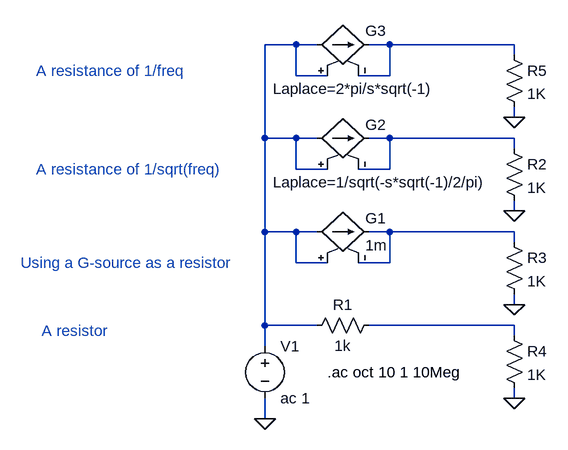
[diagram p0: schematic LaplaResis.asc]
LaplaResis.asc, the LTspice schematic file:
Version 4
SHEET 1 880 680
WIRE -96 336 -96 304
WIRE -96 192 -16 192
WIRE 64 192 288 192
WIRE 288 192 288 208
WIRE 288 288 288 304
WIRE -96 224 -96 192
WIRE 64 48 96 48
WIRE 288 48 288 64
WIRE 288 144 288 160
WIRE -16 48 -48 48
WIRE -96 48 -96 192
WIRE -48 48 -48 96
WIRE -48 48 -96 48
WIRE -48 96 0 96
WIRE 48 96 96 96
WIRE 96 96 96 48
WIRE 96 48 288 48
WIRE 64 -96 96 -96
WIRE 288 -96 288 -80
WIRE -16 -96 -48 -96
WIRE -48 -96 -48 -48
WIRE -48 -96 -96 -96
WIRE -48 -48 0 -48
WIRE 48 -48 96 -48
WIRE 96 -48 96 -96
WIRE 96 -96 288 -96
WIRE -96 -96 -96 48
WIRE 288 0 288 16
WIRE 64 -240 96 -240
WIRE 288 -240 288 -224
WIRE -16 -240 -48 -240
WIRE -48 -240 -48 -192
WIRE -48 -240 -96 -240
WIRE -48 -192 0 -192
WIRE 48 -192 96 -192
WIRE 96 -192 96 -240
WIRE 96 -240 288 -240
WIRE 288 -144 288 -128
WIRE -96 -96 -96 -240
FLAG 288 304 0
FLAG -96 336 0
FLAG 288 160 0
FLAG 288 16 0
FLAG 288 -128 0
SYMBOL res 80 176 R90
WINDOW 0 0 56 VBottom 0
WINDOW 3 32 56 VTop 0
SYMATTR InstName R1
SYMATTR Value 1k
SYMBOL voltage -96 208 R0
SYMATTR InstName V1
SYMATTR Value ac 1
SYMBOL g2 80 48 M270
WINDOW 0 21 21 VLeft 0
WINDOW 3 -21 21 VLeft 0
SYMATTR InstName G1
SYMATTR Value 1m
SYMBOL g2 80 -96 M270
WINDOW 0 21 21 VLeft 0
WINDOW 3 -68 164 VLeft 0
SYMATTR InstName G2
SYMATTR Value Laplace=1/sqrt(-s*sqrt(-1)/2/pi)
SYMBOL res 272 -96 R0
SYMATTR InstName R2
SYMATTR Value 1K
SYMBOL res 272 48 R0
SYMATTR InstName R3
SYMATTR Value 1K
SYMBOL res 272 192 R0
SYMATTR InstName R4
SYMATTR Value 1K
SYMBOL g2 80 -240 M270
WINDOW 0 21 21 VLeft 0
WINDOW 3 -68 164 VLeft 0
SYMATTR InstName G3
SYMATTR Value Laplace=2*pi/s*sqrt(-1)
SYMBOL res 272 -240 R0
SYMATTR InstName R5
SYMATTR Value 1K
TEXT 0 264 Left 0 !.ac oct 10 1 10Meg
TEXT -448 -48 Left 0 ;A resistance of 1/sqrt(freq)
TEXT -472 96 Left 0 ;Using a G-source as a resistor
TEXT -448 -200 Left 0 ;A resistance of 1/freq
TEXT -440 200 Left 0 ;A resistor

The netlist it stands for:
* LaplaResis.asc
R1 N002 N001 1k
V1 N001 0 ac 1
G1 N001 N003 N001 N003 1m
G2 N001 N004 N001 N004 Laplace=1/sqrt(-s*sqrt(-1)/2/pi)
R2 N004 0 1K
R3 N003 0 1K
R4 N002 0 1K
G3 N001 N005 N001 N005 Laplace=2*pi/s*sqrt(-1)
R5 N005 0 1K
.ac oct 10 1 10Meg
* A resistance of 1/sqrt(freq)
* Using a G-source as a resistor
* A resistance of 1/freq
* A resistor
.backanno
.end